# EasyEDA Pro project ProPrj_FOC Motor Driver _V02.epro, board PCB1
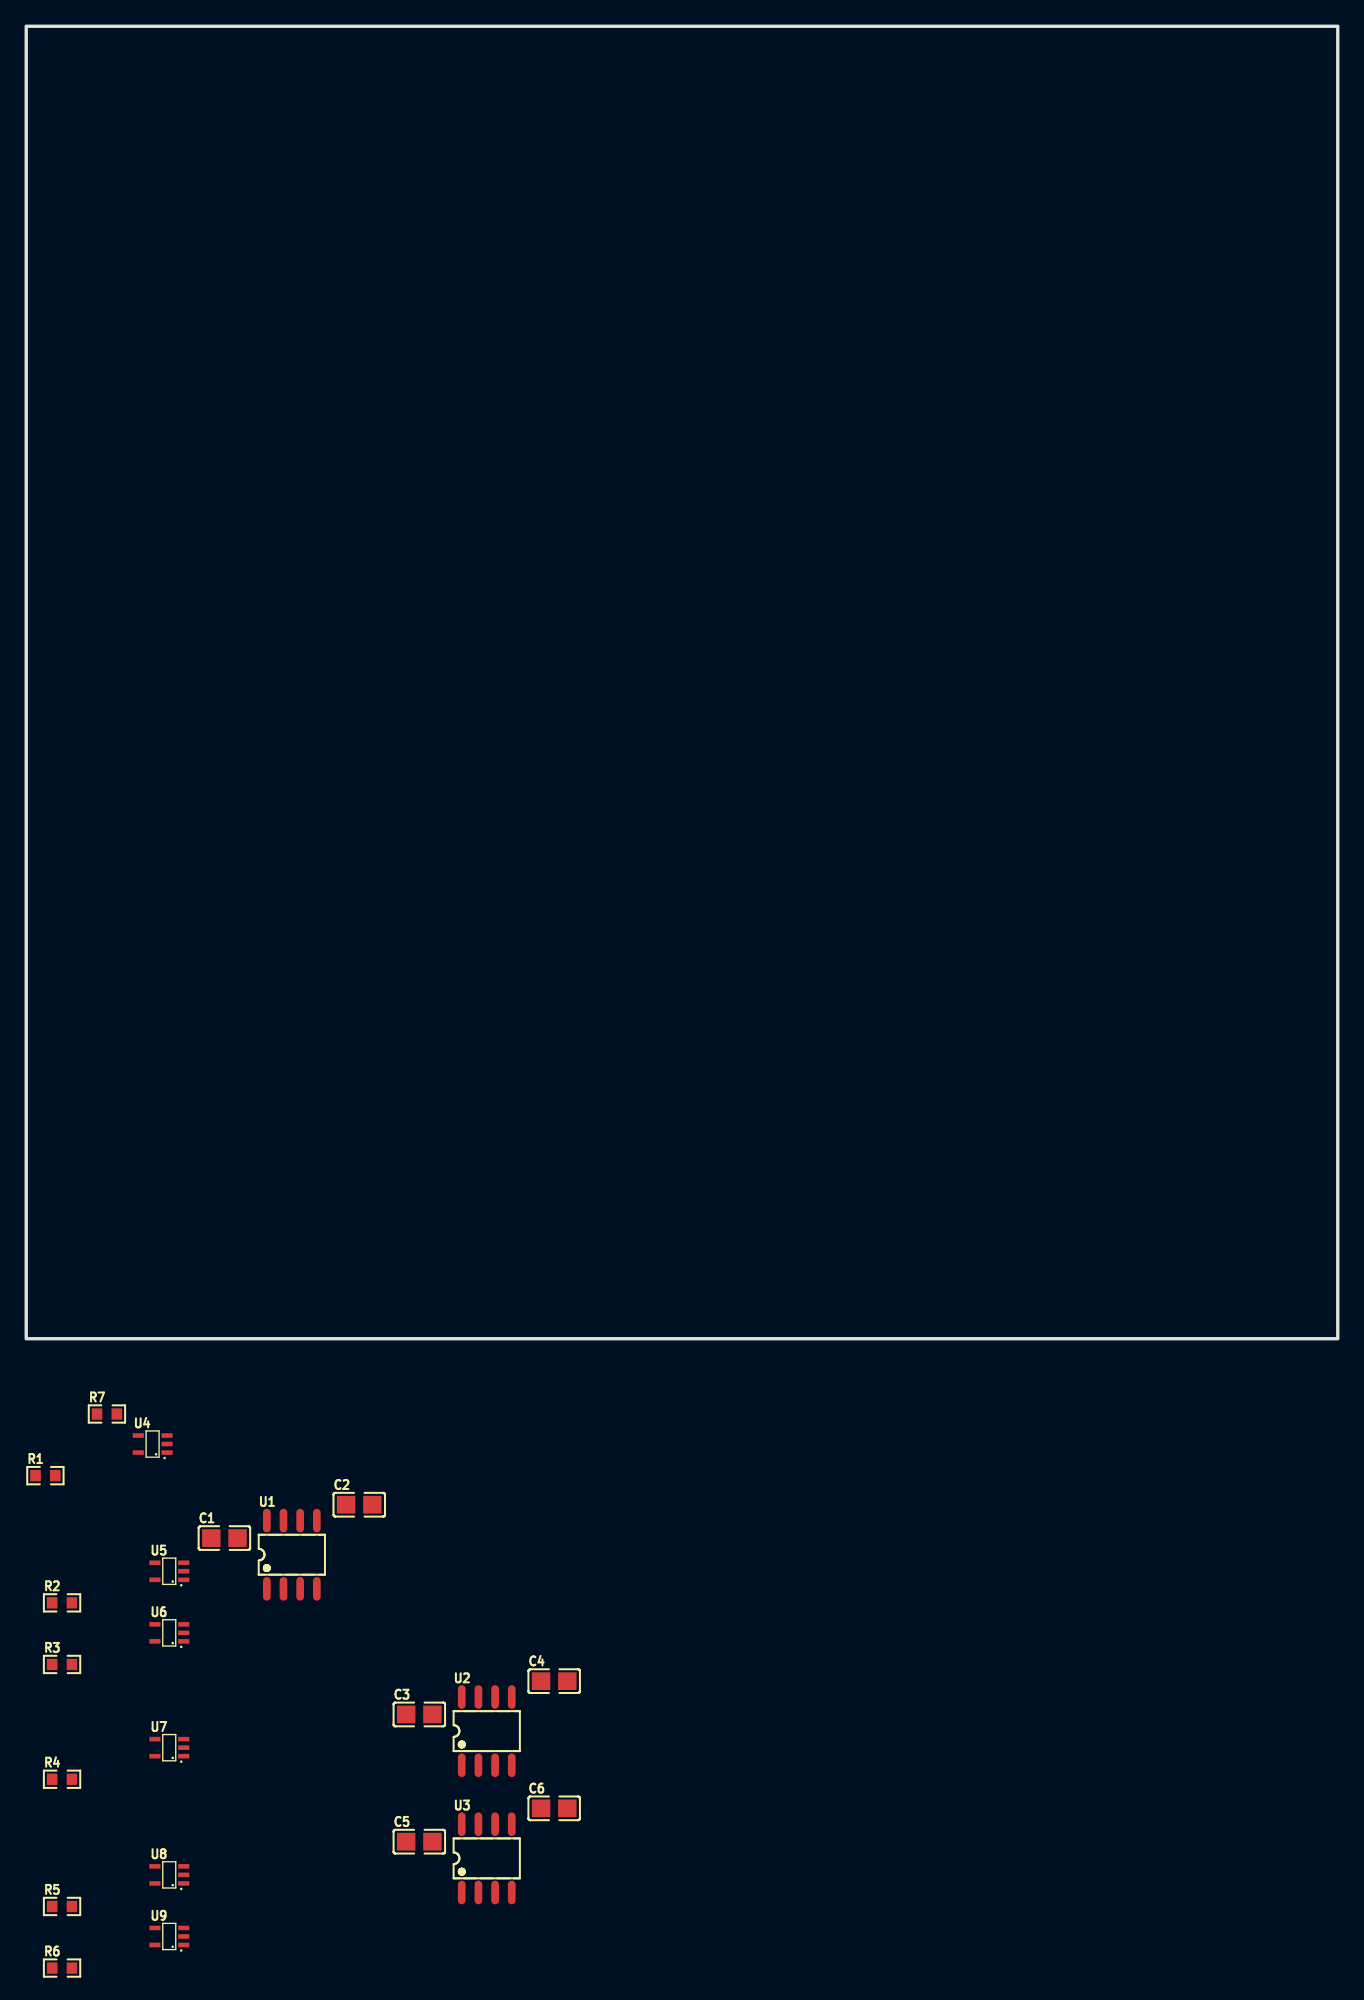
[diagram p14: board, top side]
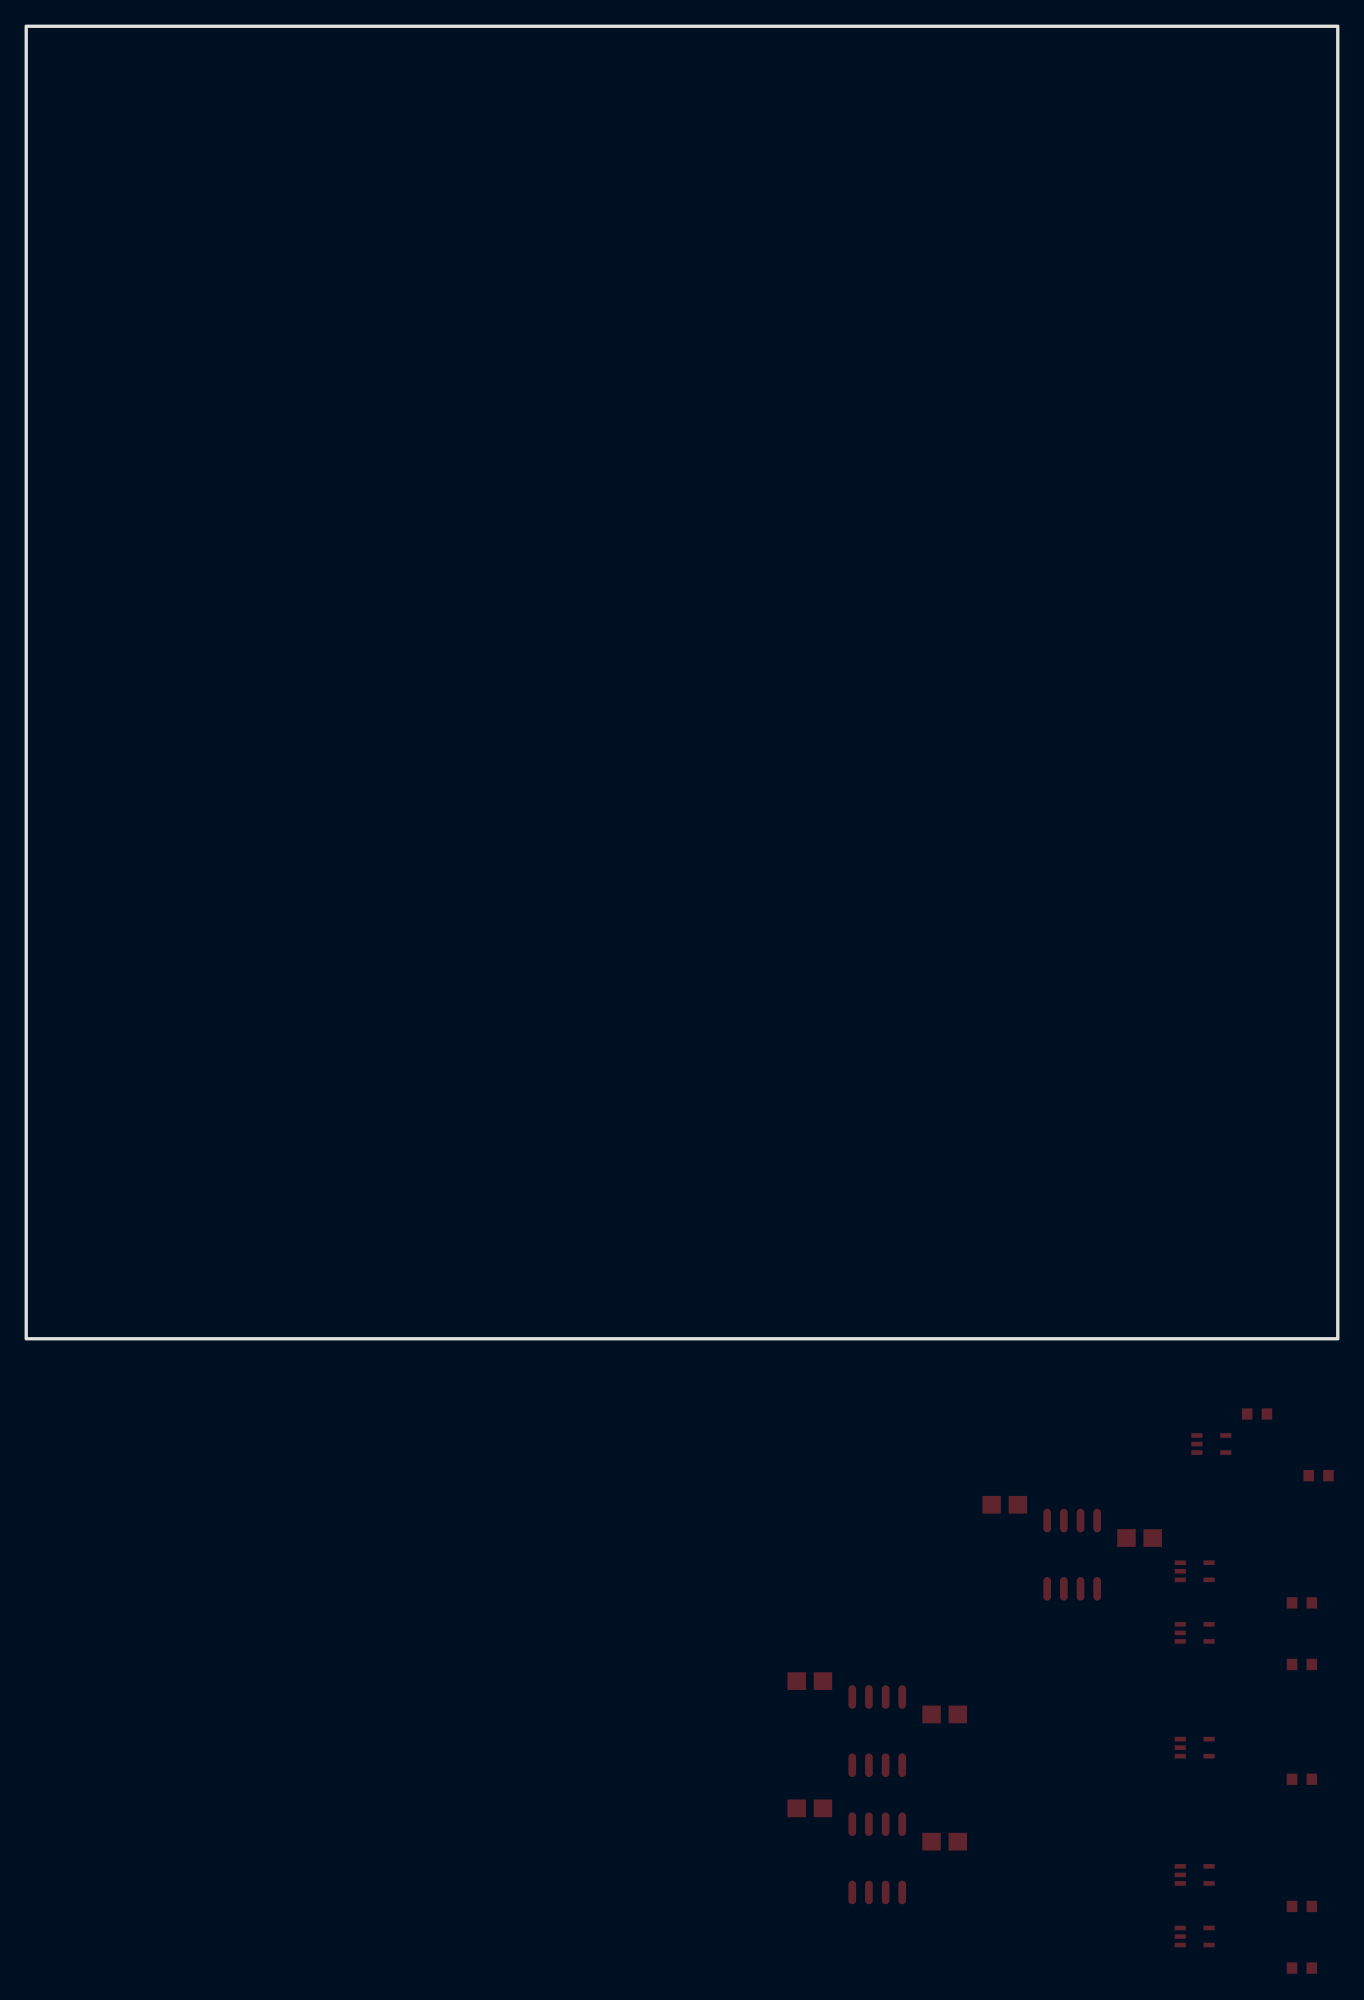
[diagram p15: board, bottom side, seen from below]

Outline 100 x 100 mm; copper layers: Top Layer, Bottom Layer. Coordinates in mm from the lower left corner of the outline.
Outline path: rectangle 0,100 100,0
Stack: Top Layer 0.035mm / Dielectric1 1.51mm FR4 er 4.5 / Bottom Layer 0.035mm

## Design rules (mm)
template: JLCPCB Capability(Two Layers Board)
spacing copperThickness1oz (default): track to track 0.102, other pairs 0.152 to 0.3
spacing copperThickness2oz: track to track 0.203, other pairs 0.152 to 0.3
track width copperThickness1oz (default): min 0.127, default 0.254, max 2.54
track width copperThickness2oz: min 0.203, default 0.254, max 2.54
differential pair differentialPair (default): width min 0.127, default 0.254, max 2.54; gap min 0.152, default 0.152
via viaSize (default): diameter min 0.5, default 0.61, max 10; hole min 0.3, default 0.305, max 6.3

## Placement (name value [footprint] x y rotation side)
C1  2.2uF  [C0805]  15.11 -15.19 0 top
C2  2.2uF  [C0805]  25.39 -12.65 0 top
C3  2.2uF  [C0805]  29.97 -28.63 0 top
C4  2.2uF  [C0805]  40.25 -26.09 0 top
C5  2.2uF  [C0805]  29.97 -38.32 0 top
C6  2.2uF  [C0805]  40.25 -35.78 0 top
R1  10kΩ  [R0603]  1.46 -10.43 0 top
R2  10kΩ  [R0603]  2.73 -20.12 0 top
R3  10kΩ  [R0603]  2.73 -24.82 0 top
R4  10kΩ  [R0603]  2.73 -33.56 0 top
R5  10kΩ  [R0603]  2.73 -43.26 0 top
R6  10kΩ  [R0603]  2.73 -47.95 0 top
R7  0Ω  [R0603]  6.15 -5.74 0 top
U1  MIC4104YML  [SOIC-8_L4.9-W3.9-P1.27-LS6.0-BL]  20.25 -16.46 0 top
U2  MIC4104YML  [SOIC-8_L4.9-W3.9-P1.27-LS6.0-BL]  35.11 -29.9 0 top
U3  MIC4104YML  [SOIC-8_L4.9-W3.9-P1.27-LS6.0-BL]  35.11 -39.59 0 top
U4  SN74LVC1G08DCKR(UMW)  [SC-70-5_L2.0-W1.3-P0.65-LS2.1-BR]  9.64 -8.02 0 top
U5  SN74LVC1G08DCKR(UMW)  [SC-70-5_L2.0-W1.3-P0.65-LS2.1-BR]  10.91 -17.72 0 top
U6  SN74LVC1G08DCKR(UMW)  [SC-70-5_L2.0-W1.3-P0.65-LS2.1-BR]  10.91 -22.41 0 top
U7  SN74LVC1G08DCKR(UMW)  [SC-70-5_L2.0-W1.3-P0.65-LS2.1-BR]  10.91 -31.16 0 top
U8  SN74LVC1G08DCKR(UMW)  [SC-70-5_L2.0-W1.3-P0.65-LS2.1-BR]  10.91 -40.85 0 top
U9  SN74LVC1G08DCKR(UMW)  [SC-70-5_L2.0-W1.3-P0.65-LS2.1-BR]  10.91 -45.54 0 top

## Footprints (pads in the part's own frame, mm; a bottom-side part is the same pattern mirrored in y, then rotated)
C0805
  rect 1.41x1.35 smd: 1(-1,0) 2(1,0)
R0603
  rect 0.806x0.864 smd: 1(-0.753,0) 2(0.753,0)
SC-70-5_L2.0-W1.3-P0.65-LS2.1-BR
  rect 0.85x0.35 smd: 1(1.1,-0.65) 2(1.1,0) 3(1.1,0.65) 4(-1.1,0.65) 5(-1.1,-0.65)
SOIC-8_L4.9-W3.9-P1.27-LS6.0-BL
  oval 0.588x1.8 smd: 1(-1.905,-2.6) 2(-0.635,-2.6) 3(0.635,-2.6) 4(1.905,-2.6) 5(1.905,2.6) 6(0.635,2.6) 7(-0.635,2.6) 8(-1.905,2.6)

## Nets
As in the schematic.
